# EAGLE design new work 1 (EAGLE 9.6.2)
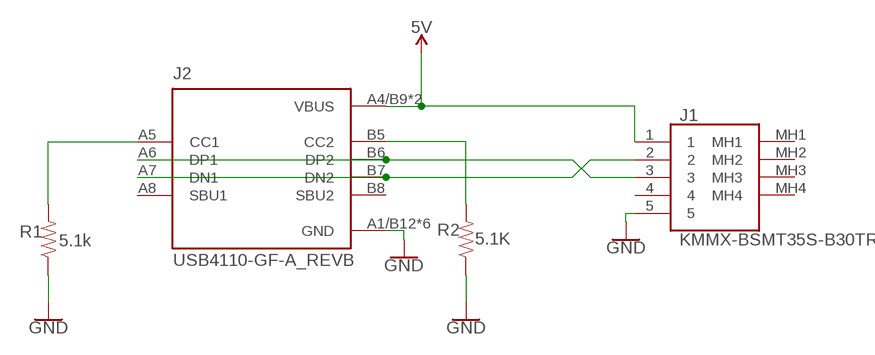
[diagram p0: schematic, sheet 1]

## Parts
J1  KMMX-BSMT35S-B30TR  [KMMXBSMT35SB30TR]
J2  USB4110-GF-A_REVB  [GCT_USB4110-GF-A_REVB]
R1  5.1k  RESISTOR0402T  [0402-TIGHT]
R2  5.1K  RESISTOR0402T  [0402-TIGHT]

## Nets
5V: J1.1 J2.A4/B9(VBUS) J2.B4/A9(VBUS)
GND: J1.5 J2.A1/B12(GND) J2.B1/A12(GND) J2.S1(GND) J2.S2(GND) J2.S3(GND) J2.S4(GND) R1.1 R2.1
N$3: J1.3 J2.A6(DP1) J2.B6(DP2)
N$4: J1.2 J2.A7(DN1) J2.B7(DN2)
N$5: J2.B5(CC2) R2.2
N$6: J2.A5(CC1) R1.2
Unconnected: J1.4 J1.MH1 J1.MH2 J1.MH3 J1.MH4 J2.A8(SBU1) J2.B8(SBU2)

## Library data of the parts
J1 = KMMX-BSMT35S-B30TR:KMMX-BSMT35S-B30TR: CONN RCPT USB MICRO B SMD RA Source: Datasheet <http://www.kycon.com/Pub_Eng_Draw/KMMX-BSMT35S-BTR.pdf>; DESCRIPTION: CONN RCPT USB MICRO B SMD RA; HEIGHT: 2.18mm; MANUFACTURER_NAME: Kycon; MANUFACTURER_PART_NUMBER: KMMX-BSMT35S-B30TR; MOUSER_PART_NUMBER: 806-KMMXBSMT35SB30TR; MOUSER_PRICE-STOCK: https://www.mouser.co.uk/ProductDetail/Kycon/KMMX-BSMT35S-B30TR?qs=vdesqFACzykLVhcFlQ5ZeA%3D%3D
J2 = USB4110-GF-A_REVB:USB4110-GF-A_REVB: Check availability <https://pricing.snapeda.com/parts/USB4110-GF-A/GCT/view-part?ref=eda>; AVAILABILITY: In Stock; DESCRIPTION: USB-C (USB TYPE-C) USB 2.0 Receptacle Connector 24 (16+8 Dummy) Position Surface Mount, Right Angle; Through Hole; MF: GCT; MP: USB4110-GF-A; PACKAGE: None; PRICE: None; PURCHASE-URL: https://pricing.snapeda.com/search/part/USB4110-GF-A/?ref=eda
R1 R2 = SparkFun-Resistors:RESISTOR: Generic Resistor Package

## Board
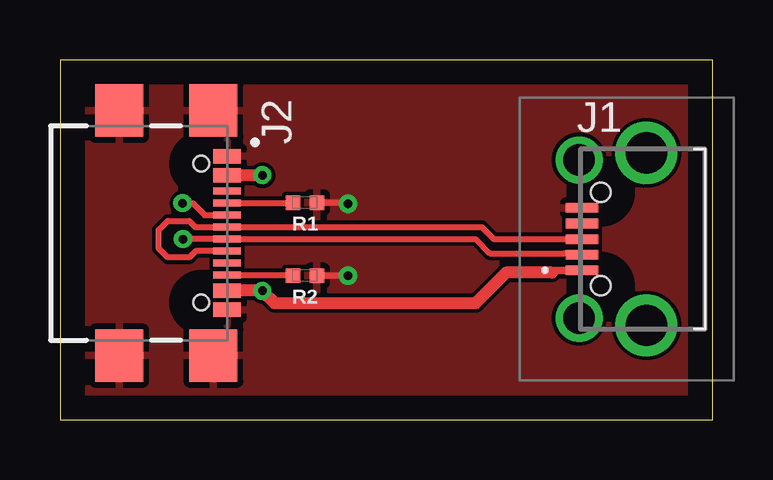
[diagram p1: board, top side]
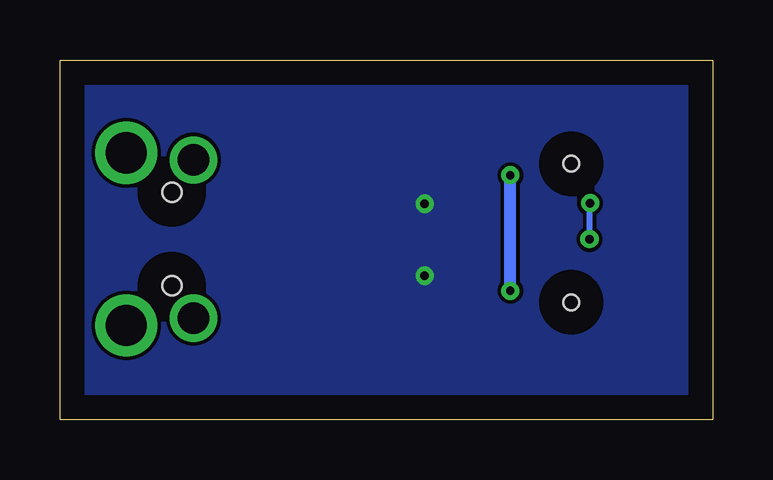
[diagram p2: board, bottom side, seen from below]

Size 27.19 x 15 mm. Coordinates in mm from the lower left corner, seen from the top.
Outline: 0,0 27.19,0 27.19,15 0,15 0,0
Copper layers (1*16): Top 0.035mm / dielectric 1.5mm / Bottom 0.035mm
Design rules "default": minimum track width 6mil, minimum drill 0.35mm, track to track 6mil, track to pad 6mil, pad to pad 6mil, via to via 6mil, smd to smd 6mil, copper to edge 40mil, drill to drill 6mil, minimum pad ring 10mil, minimum via ring 8mil, stop-mask expansion 4mil, vias tented up to drill 0mil, thermal gap 10mil

### Footprints (pad centres in the part's own frame; a part is rotated, then mirrored left to right if it is on the bottom)
KMMXBSMT35SB30TR = smd 0.4 x 1.35: 1 -1.3,2.675; 2 -0.65,2.675; 3 0,2.675; 4 0.65,2.675; 5 1.3,2.675 | drill 1.724 pad 2.586: MH1 -3.6,0; MH2 3.6,0 | drill 1.312 pad 1.969: MH3 -3.3,2.8; MH4 3.3,2.8 | hole 0.8: -1.95,1.9; 1.95,1.9
GCT_USB4110-GF-A_REVB = smd 0.6 x 1.15: A1/B12 -3.2,1.075; A4/B9 -2.4,1.075; B1/A12 3.2,1.075; B4/A9 2.4,1.075 | smd 0.3 x 1.15: A5 -1.25,1.075; A6 -0.25,1.075; A7 0.25,1.075; A8 1.25,1.075; B5 1.75,1.075; B6 0.75,1.075; B7 -0.75,1.075; B8 -1.75,1.075 | smd 2.18 x 2: S1 -5.11,0.5; S2 5.11,0.5; S3 -5.11,-3.43; S4 5.11,-3.43 | hole 0.65: -2.89,0; 2.89,0
0402-TIGHT = smd 0.6 x 0.6: 1 -0.5,0; 2 0.5,0

### Placement (x,y rotation side)
J1  24.43,7.53 90 top
J2  5.89,7.78 270 top
R1  10.21,9.05 180 top
R2  10.21,6 180 top

### Tracks (layer width: path | path; a pad name or v marks a point on that pad's centre or on a via)
5V  (via drill 0.35)
  Top 0.305: J1.1 20.59,6.23 20.5,6.13 | 8,10.18 7.51,10.18 J2.A4/B9
  Top 0.508: J2.B4/A9 8.42,5.38 v8.43,5.37 8.94,4.86 17.32,4.86 18.59,6.13 20.5,6.13 | v8.43,10.19 8.42,10.18 8,10.18 7.48,10.18
  Bottom 0.508: v8.43,5.37 v8.43,10.19
GND  (via drill 0.35)
  Top 0.254: R1.1 11.95,9.05 v12,9 | R2.1 v12,6
  pour Top: -1,18 31,18 33,16 33,13 33,-3 32,-4 0,-4 -2,-2 -3,-1 -3,15 -3,16
  pour Bottom: -1,19 30,19 33,16 33,-3 31,-5 -1,-5 -4,-2 -4,16
N$3
  Top 0.254: J2.B6 5.65,7.03 5.38,6.76 4.49,6.76 4.11,7.14 4.11,7.91 4.49,8.29 5.38,8.29 5.64,8.03 J2.A6 17.58,8.03 18.08,7.53 J1.3
N$4  (via drill 0.35)
  Top 0.254: v5.13,7.53 J2.A7 17.32,7.53 17.92,6.93 21,6.93 21.7,6.93 J1.2 | v5.1,9.02 5.53,9.02 6.03,8.53 J2.B7
  Bottom 0.254: v5.13,7.53 5.13,9 v5.1,9.02
N$5
  Top 0.254: J2.B5 9.68,6.03 R2.2
N$6
  Top 0.254: J2.A5 9.69,9.03 R1.2